# Altium schematic sheet ACCU23-ESF.SchDoc
size A4
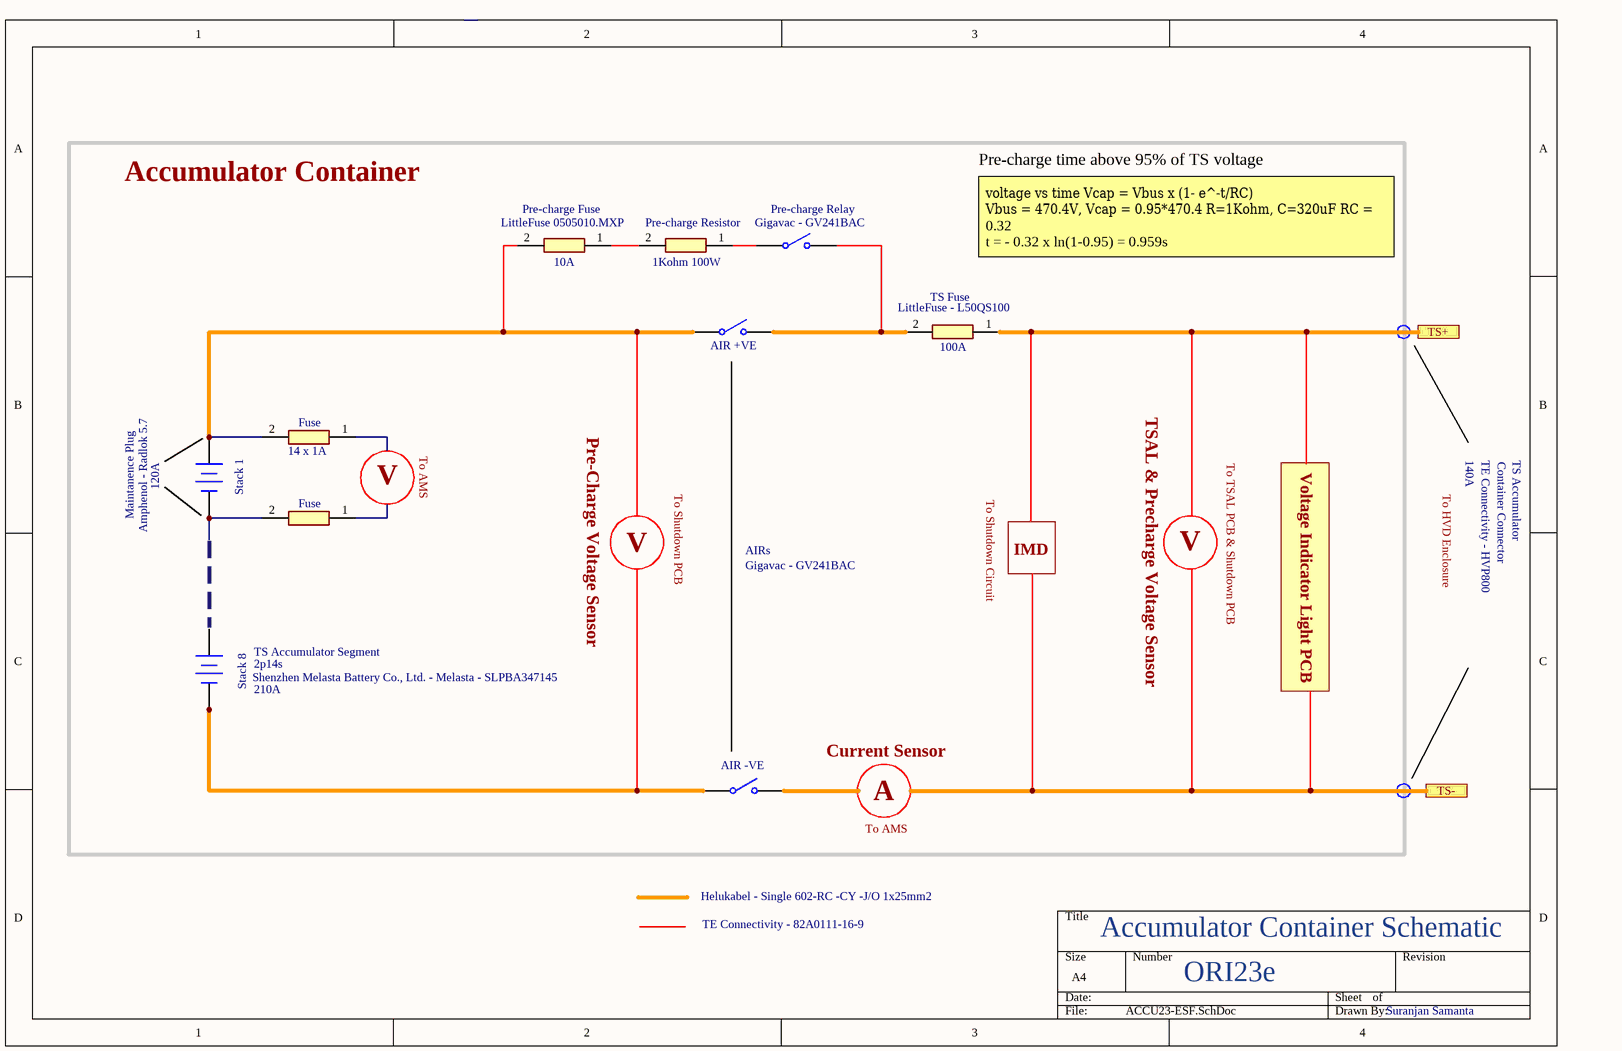
[diagram p0: ACCU23-ESF.SchDoc]

## Parts
(Parts that share a designator on the sheet are numbered #1, #2 ... from top to bottom, then left to right.)
BT?#1  Stack 1  [BAT-2]
BT?#2  Stack 8  [BAT-2]
Fuse#1  14 x 1A  [RESC3126X60N]
Fuse#2  16 x 3A  [RESC3126X60N]  (value not drawn)
Pre-charge_Fuse  10A  [RESC3126X60N]
Pre-charge_Resistor  1Kohm 100W  [RESC3126X60N]
S?#1  Pre-charge Relay  [SPST-2]
S?#2  AIR +VE  [SPST-2]
S?#3  AIR -VE  [SPST-2]
TS_Fuse  100A  [RESC3126X60N]

## Ports
TS+, TS-

## Nets
TS+: TS_Fuse.1 ; port TS+
NetBT?#1_1: BT?#1.1(+) Fuse#1.2 Pre-charge_Fuse.2 S?#2.1(COMMON)
NetBT?#1_2: BT?#1.2(-) Fuse#2.2
NetBT?#2_2: BT?#2.2(-) S?#3.1(COMMON)
NetPre-charge_Fuse_1: Pre-charge_Fuse.1 Pre-charge_Resistor.2
NetPre-charge_Resistor_1: Pre-charge_Resistor.1 S?#1.1(COMMON)
NetS?#1_2: S?#1.2(NO) S?#2.2(NO) TS_Fuse.2

Not connected (* = marked no-connect by the designer): BT?#2 1(+); Fuse#1 1; Fuse#2 1; S?#3 2(NO)

## Notes on the sheet
- Accumulator Container
- Pre-charge time above 95% of TS voltage
- (near Pre-charge_Fuse) LittleFuse 0505010.MXP
- (near S?#1) Gigavac - GV241BAC
- voltage vs time V​cap​ = V​bus​ x (1- e^​-t/RC​)
  V​bus​ = 470.4V, Vcap = 0.95*470.4 R=1Kohm, C=320uF RC = 0.32
  t = - 0.32 x ln(1-0.95) = 0.959s
  Peak current = V​bus​/R = 0.47Amps
- (near TS_Fuse) LittleFuse - L50QS100
- To AMS
- Pre-Charge Voltage Sensor
- TSAL & Precharge Voltage Sensor
- To TSAL PCB & Shutdown PCB
- 140A
- TE Connectivity - HVP800
- Container Connector
- TS Accumulator
- Maintanence Plug
- Amphenol - Radlok 5.7
- (near BT?#1) 120A
- (near Fuse#1) V
- To Shutdown PCB
- To Shutdown Circuit
- Voltage Indicator Light PCB
- To HVD Enclosure
- V
- AIRs
- Gigavac - GV241BAC
- IMD
- (near BT?#2) TS Accumulator Segment
- (near BT?#2) 2p14s
- (near BT?#2) Shenzhen Melasta Battery Co., Ltd. - Melasta - SLPBA347145
- (near BT?#2) 210A
- Current Sensor
- A
- Helukabel - Single 602-RC -CY -J/O 1x25mm2
- TE Connectivity - 82A0111-16-9
- Accumulator Container Schematic
- ORI23e
- Suranjan Samanta

## Library data of the parts
BT?#1 BT?#2 = Battery: Multicell Battery; Published: 24-Mar-1999; LatestRevisionDate: 17-Jul-2002; LatestRevisionNote: Re-released for DXP Platform.; PackageReference: BAT-2; Publisher: Altium Limited; PackageDescription: Battery; 2 Leads
Fuse#1 Fuse#2 Pre-charge_Fuse Pre-charge_Resistor TS_Fuse = RC1210JR-0710KL: Resistor; Manufacturer_Name: YAGEO (PHYCOMP); Datasheet Link: http://www.yageo.com/documents/recent/PYu-RC1210_51_RoHS_L_(4).pdf; Height: 0.6mm; Manufacturer_Part_Number: RC1210JR-0710KL; Mouser Part Number: 603-RC1210JR-0710KL; Mouser Price/Stock: https://www.mouser.com/Search/Refine.aspx?Keyword=603-RC1210JR-0710KL
S?#1-S?#3 = SW-SPST: Single-Pole, Single-Throw Switch; Published: 24-Mar-1999; LatestRevisionDate: 17-Jul-2002; LatestRevisionNote: Re-released for DXP Platform.; PackageReference: SPST-2; Publisher: Altium Limited; PackageDescription: Switch; 2 Leads